# Altium schematic sheet sensor_specific.SchDoc
size A4
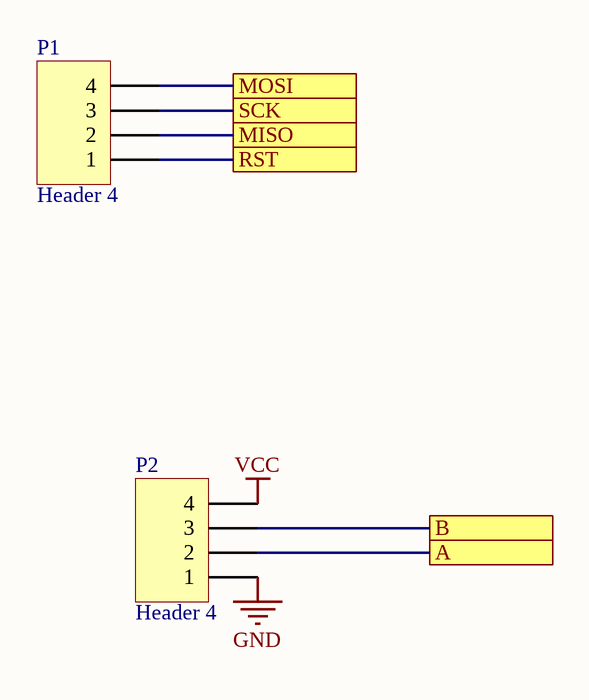
[diagram p0: sensor_specific.SchDoc]

## Parts
P1  Header 4  [HDR1X4]
P2  Header 4  [HDR1X4]

## Ports
A, B, MISO, MOSI, RST, SCK

## Nets
GND: P2.1
VCC: P2.4
A: P2.2 ; port A
B: P2.3 ; port B
MISO: P1.2 ; port MISO
MOSI: P1.4 ; port MOSI
RST: P1.1 ; port RST
SCK: P1.3 ; port SCK

## Library data of the parts
P1 P2 = Header 4: Header, 4-Pin; LatestRevisionDate: 17-Jul-2002; LatestRevisionNote: Re-released for DXP Platform.; Publisher: Altium Limited